# EAGLE design VarmoEmergencyStop - Rev A2 (EAGLE 7.6.2)
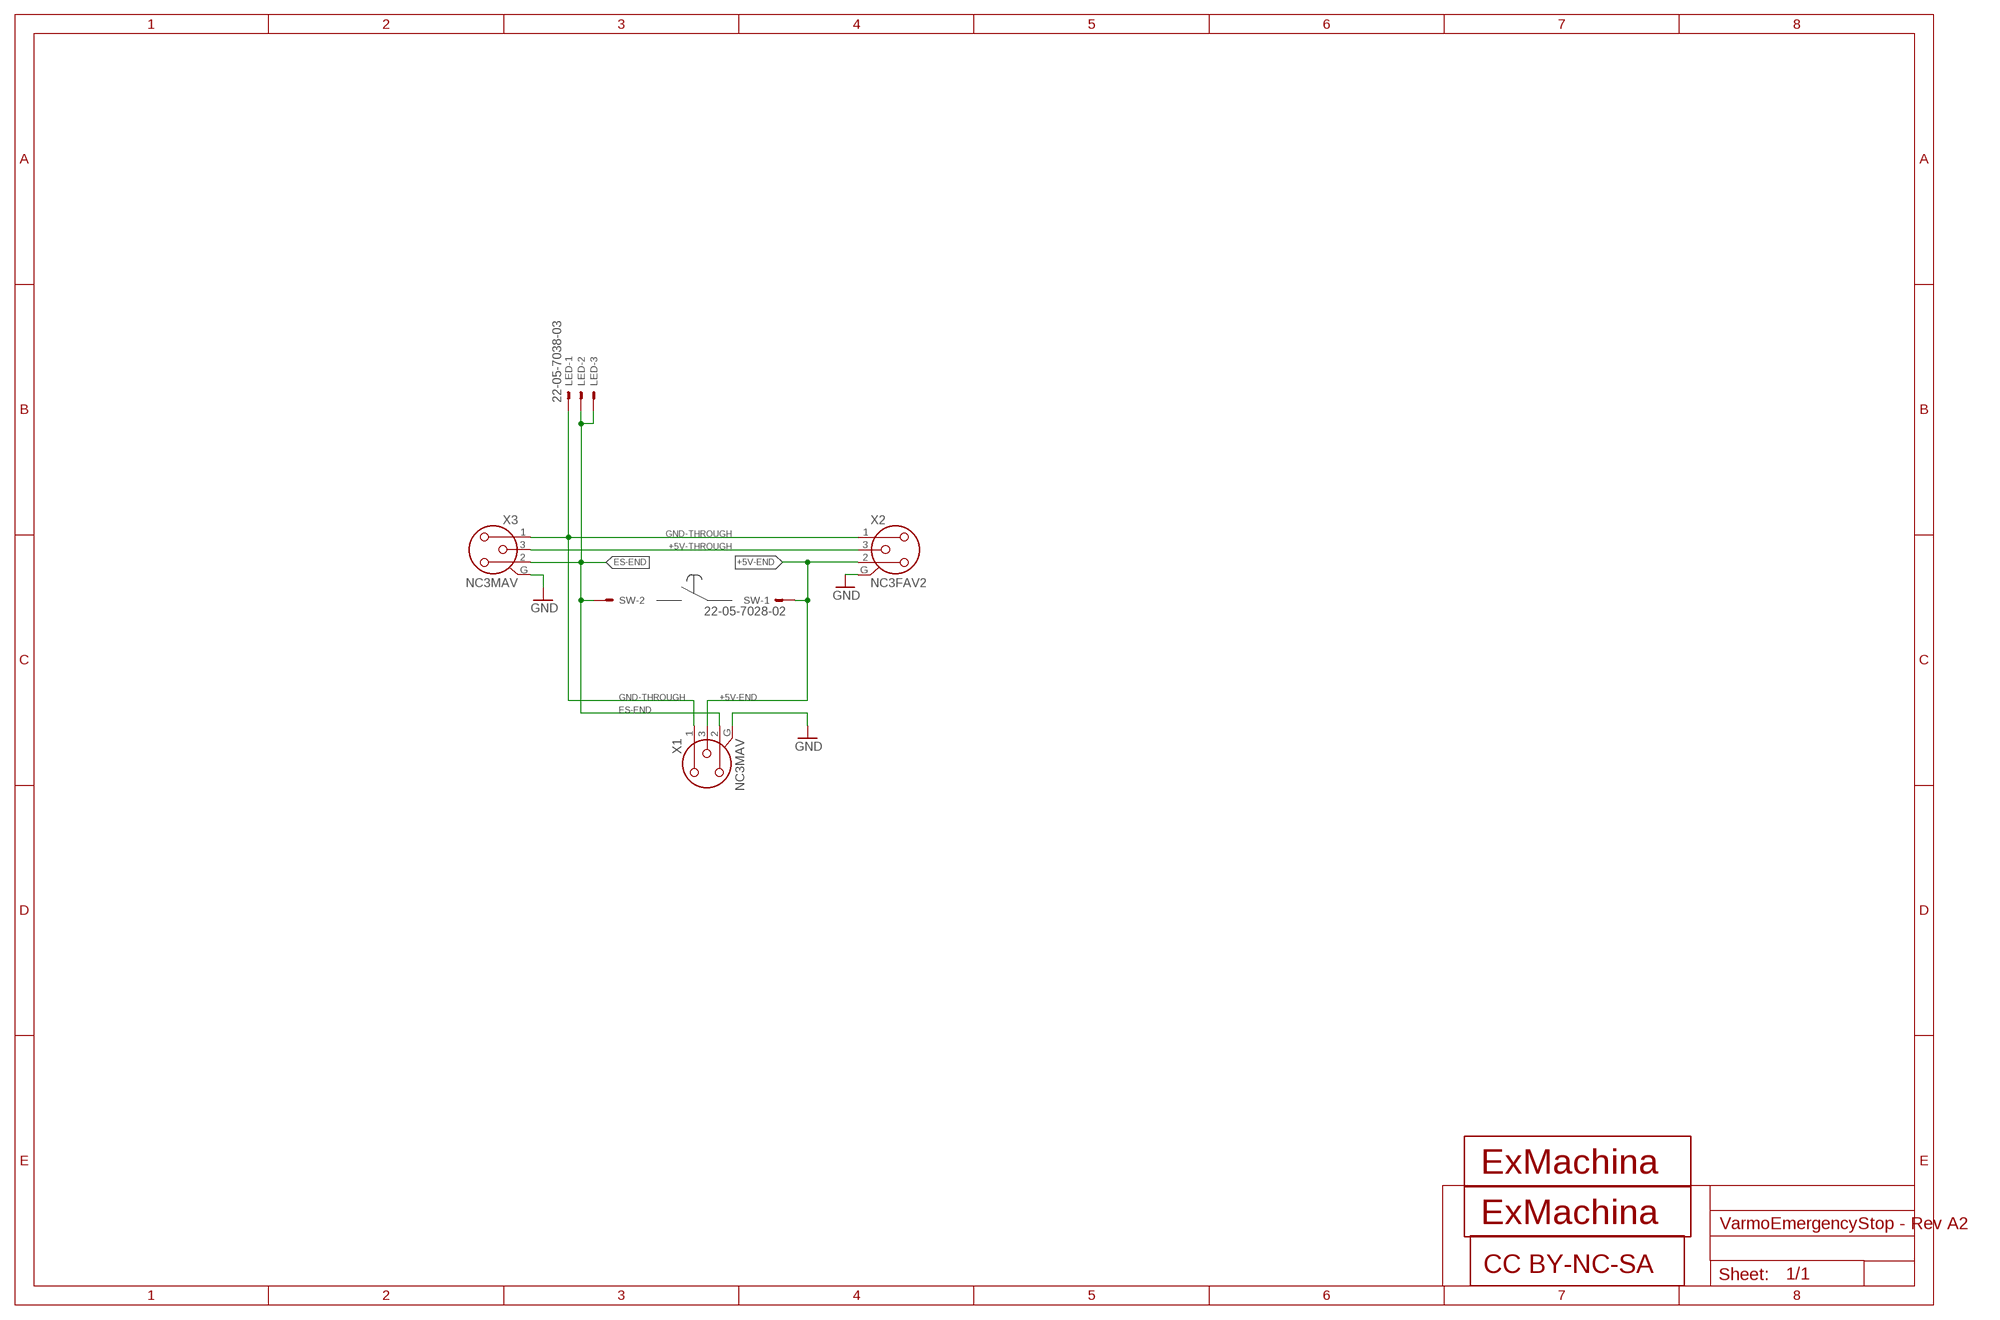
[diagram p0: schematic, sheet 1]

## Parts
LED  22-05-7038-03  [7395-03]
SW  22-05-7028-02  [7395-02]
U$1  EXMACHINA-LOGO-NAME  [EXM-LOGO-BASELINE]
U$2  CC-BY-NC-SA  [CC-BY-NC-SA]
U$3  EXMACHINA-LOGO-NAME  [EXM-LOGO-BASELINE]
X1  NC3MAV  [NC3MAV]
X2  NC3FAV2  [NC3FAV2]
X3  NC3MAV  [NC3MAV]

## Nets
+5V-END [power]: SW.1 X1.3 X2.2
+5V-THROUGH [power]: X2.3 X3.3
ES-END [power]: LED.2 LED.3 SW.2 X1.2 X3.2
GND [power]: X1.G X2.G X3.G
GND-THROUGH [power]: LED.1 X1.1 X2.1 X3.1

## Library data of the parts
LED = con-molex:22-?-03: CONNECTOR wire to board 2.54 mm (.1 inch) pitch header; OC_FARNELL: 9731610; OC_NEWARK: unknown
SW = con-molex:22-?-02: CONNECTOR wire to board 2.54 mm (.1 inch) pitch header; OC_FARNELL: 9731601; OC_NEWARK: unknown
U$1 U$3 = exmachina:EXMACHINA-LOGO
U$2 = cc-by-sa:CC-BY-NC-SA
X1 X3 = con-neutrik_ag:NC3: Neutrik Audio Connector XLR SERIES Stereo 1/4" jack Source: www.neutrik.com/; MF: FARNELL; MPN: NC3MAV; OC_FARNELL: 724531; OC_NEWARK: 46WX3058
X2 = con-neutrik_ag:NC3: Neutrik Audio Connector XLR SERIES Stereo 1/4" jack Source: www.neutrik.com/; MF: NEUTRIK; MPN: NC3FAV2; OC_FARNELL: unknown; OC_NEWARK: 83F7211

## Net classes
0 default: width 0.152 mm
1 power: width 0.813 mm, clearance 0.254 mm

## Board
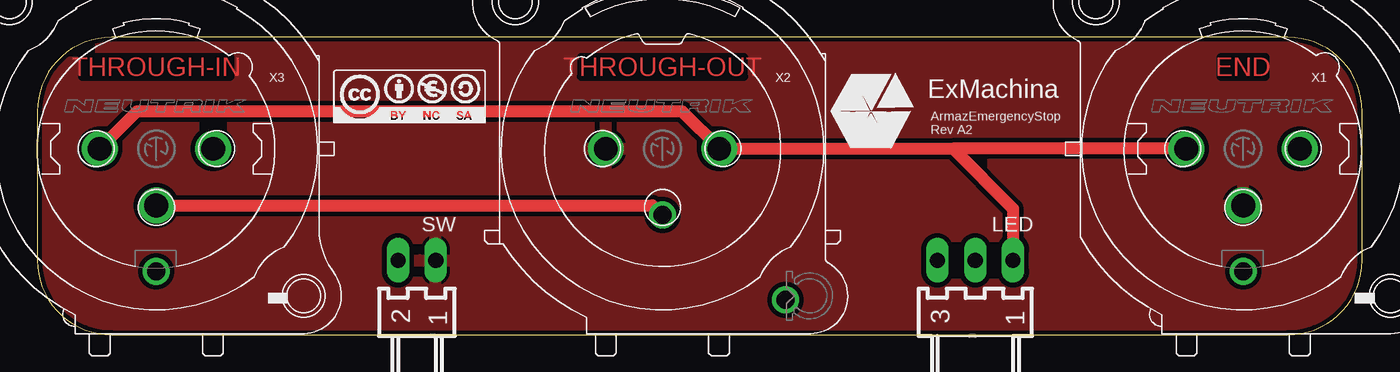
[diagram p1: board, top side]
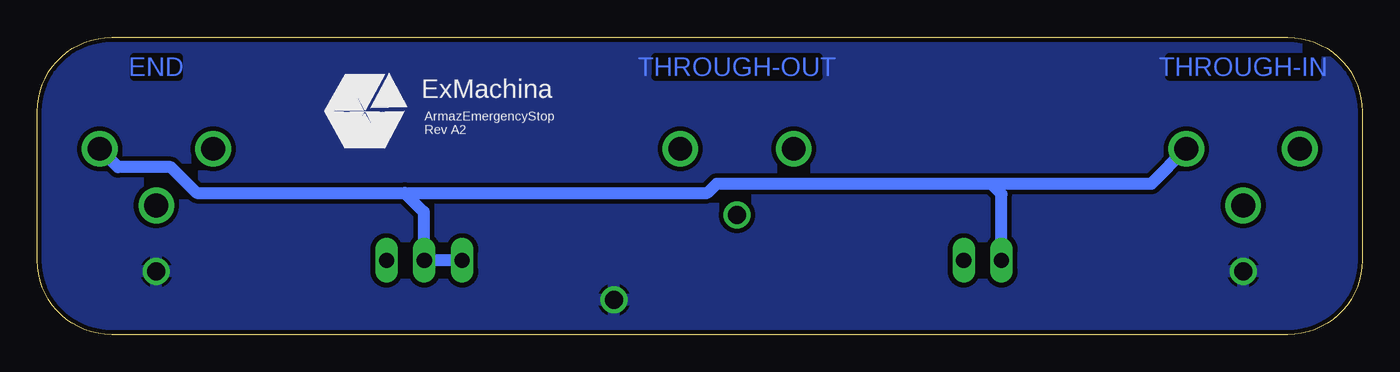
[diagram p2: board, bottom side, seen from below]

Size 89 x 20 mm. Coordinates in mm from the lower left corner, seen from the top.
Outline: 89,5 89,15 arc90 84,20 5,20 arc90 0,15 0,5 arc90 5,0 84,0 arc90 89,5
Copper layers (1*16): Top 0.018mm / dielectric 1.55mm / Bottom 0.018mm
Design rules "eC_2Layer_PClass6_BaseCopperO18_eCDefault": minimum track width 0.15mm, minimum drill 0.35mm, track to track 0.15mm, track to pad 0.15mm, pad to pad 0.15mm, via to via 0.15mm, smd to smd 0mil, copper to edge 0.25mm, drill to drill 0.35mm, minimum pad ring 0.175mm, minimum via ring 0.125mm, stop-mask expansion 0mil, vias tented up to drill 0.45mm, thermal gap 0.2mm

### Footprints (pad centres in the part's own frame; a part is rotated, then mirrored left to right if it is on the bottom)
7395-03 = drill 1.016 long: 1 2.54,0; 2 0,0; 3 -2.54,0
7395-02 = drill 1.016 long: 1 1.27,0; 2 -1.27,0
NC3MAV = drill 1.6: 1 -3.81,0; 2 3.81,0; 3 0,-3.81 | drill 1.2: G 0,-8.255
NC3FAV2 = drill 1.6: 1 3.81,0; 2 -3.81,0 | drill 1.2: 3 0,-4.45; G 8.25,-10.16

### Placement (x,y rotation side)
LED  63,5 0 top
SW  25.5,5 0 top
U$1  56,15 0 top
U$2  25,16 0 top
U$3  67,15 0 bottom
X1  81,12.5 0 top
X2  42,12.5 0 top
X3  8,12.5 0 top

### Tracks (layer width: path | path; a pad name or v marks a point on that pad's centre or on a via)
+5V-END
  pour Top (isolate 0.305): -4,-4 93,-4 93,24 -4,24
+5V-THROUGH
  Top 0.813: X3.3 41.31,8.69 41.95,8.05 X2.3
ES-END
  Bottom 0.813: X1.2 83.58,11.27 80.03,11.27 78.28,9.53 64.31,9.53 | LED.3 LED.2 63.04,5.04 63.04,8.26 64.31,9.53 | 64.31,9.53 43.99,9.53 43.35,10.16 24.94,10.16 | 24.94,10.16 14.15,10.16 X3.2 | SW.2 24.23,9.45 24.94,10.16
GND
  pour Bottom (isolate 0.305): -3,-3 92,-3 92,23 -3,23
GND-THROUGH
  Top 0.813: X3.1 6.69,15 43.31,15 X2.1 61,12.5 61.5,12.5 | 61.5,12.5 65.54,8.46 LED.1 | X1.1 61.5,12.5

### Text on the board
Top: THROUGH-IN | THROUGH-OUT | END
Bottom: THROUGH-IN | THROUGH-OUT | END
tPlace: ArmazEmergencyStop / Rev A2
bPlace: ArmazEmergencyStop / Rev A2